# EAGLE design HF1R00 (EAGLE 9.3.0)
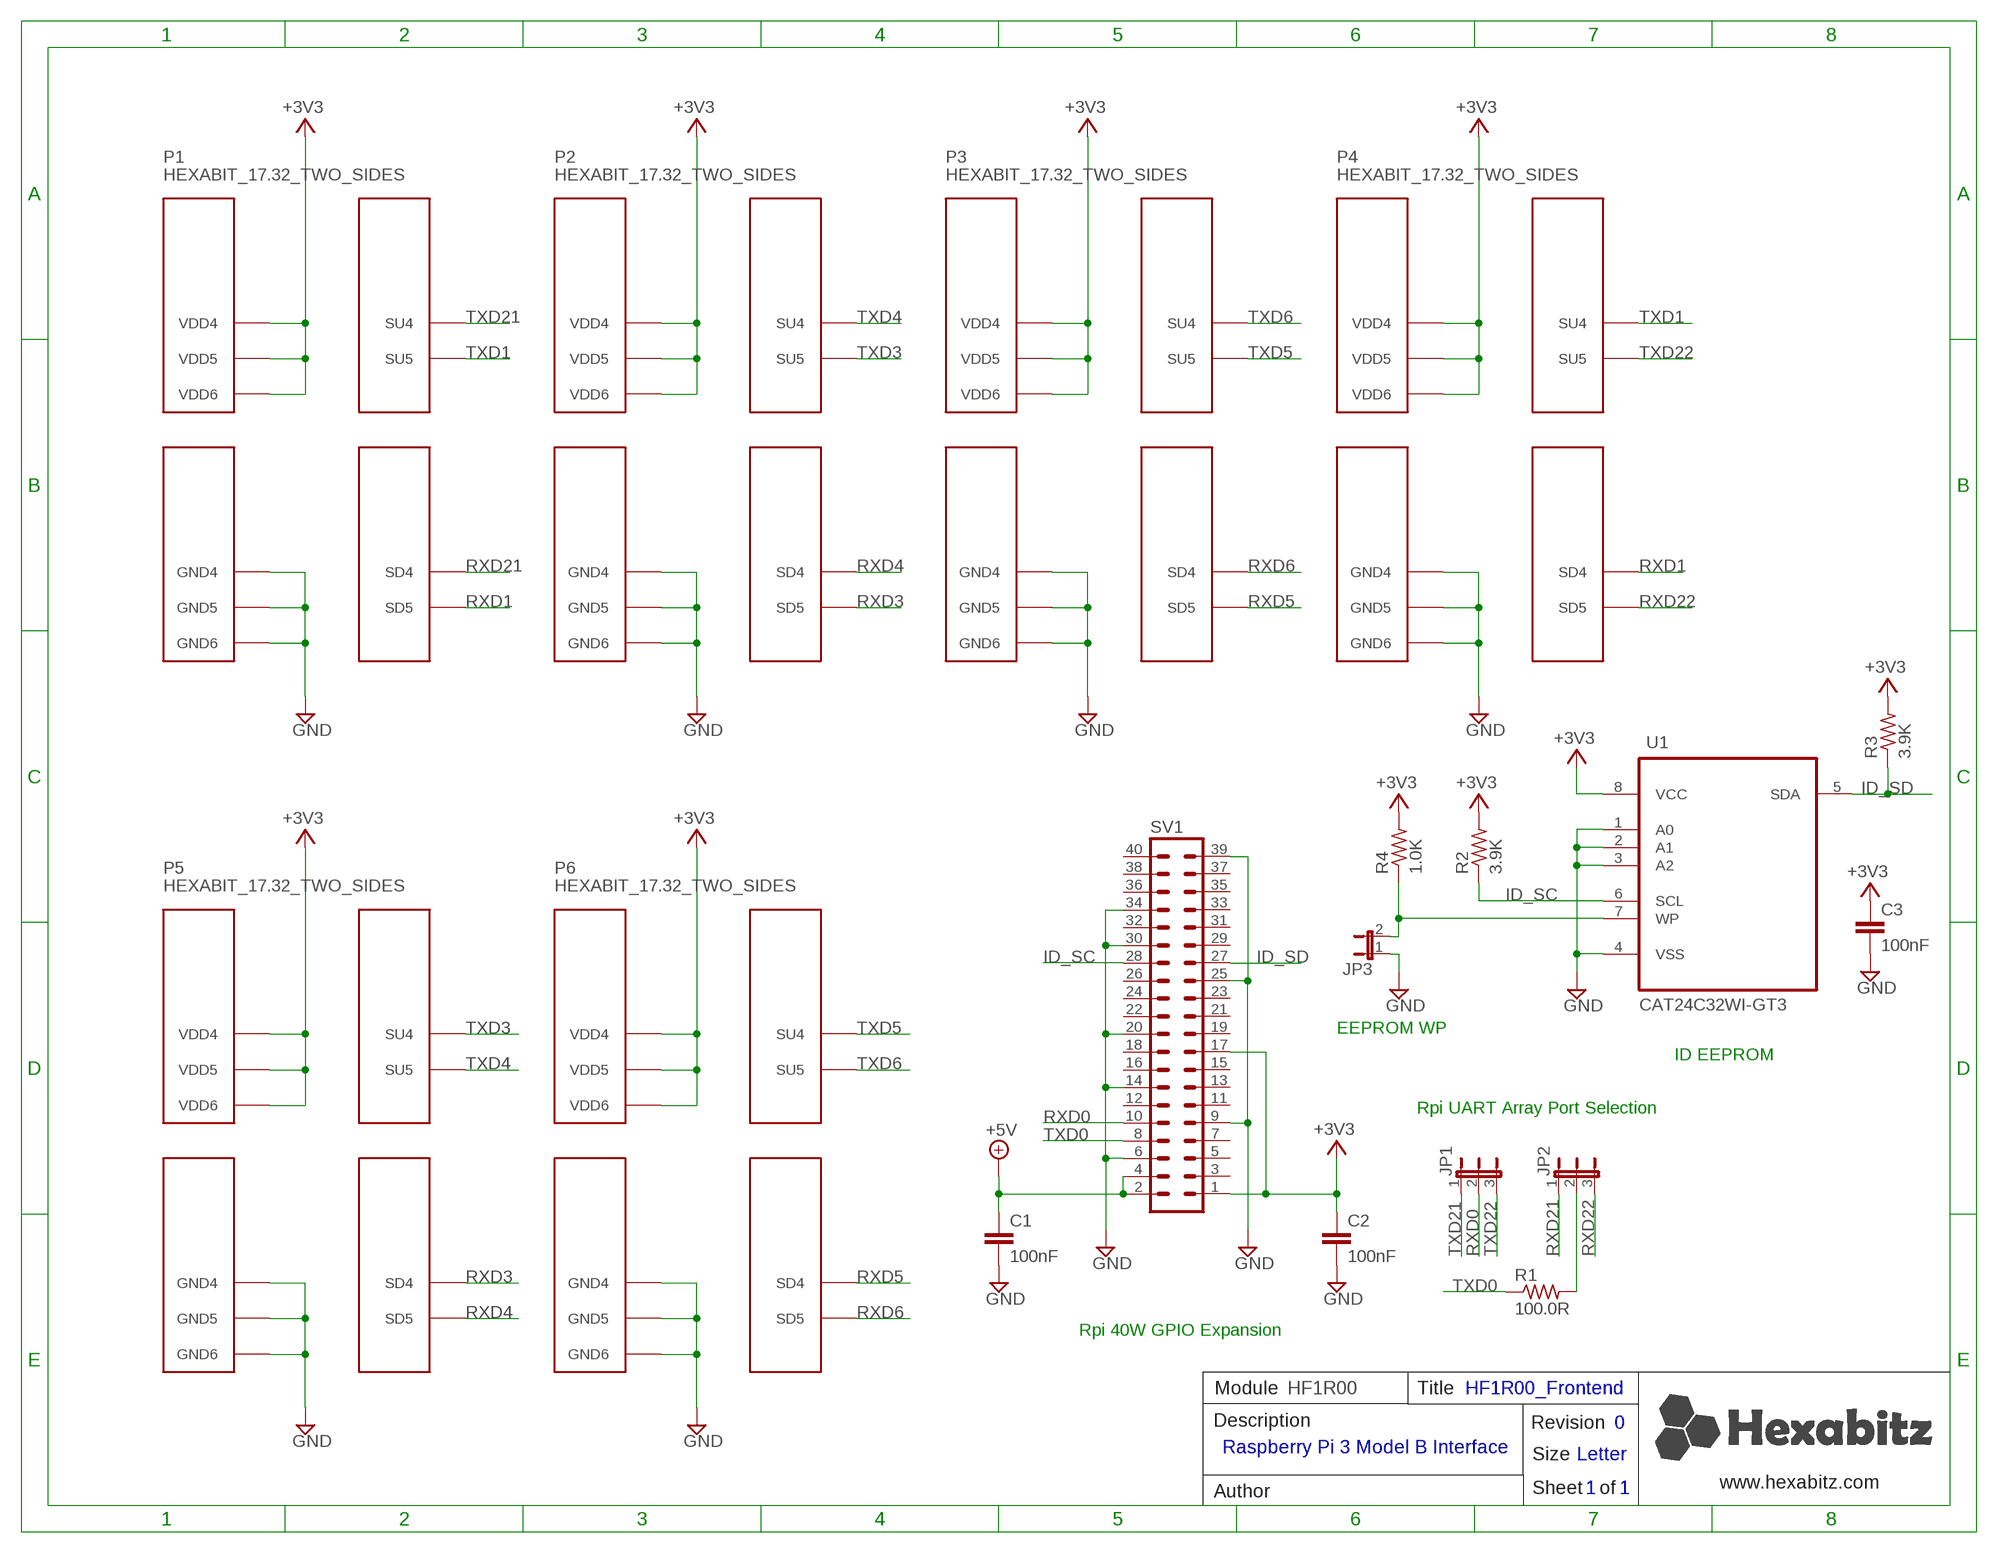
[diagram p0: schematic, sheet 1]

## Parts
C1  100nF  C-0603  [C-0603]
C2  100nF  C-0603  [C-0603]
C3  100nF  C-0603  [C-0603]
JP1  61300311121  JP2E  [JP2]
JP2  61300311121  JP2E  [JP2]
JP3  61300211121  JP1E  [JP1]
P1  HEXABIT_17.32_TWO_SIDES  [HEXABIT_17.32_TWO_SIDES]
P2  HEXABIT_17.32_TWO_SIDES  [HEXABIT_17.32_TWO_SIDES]
P3  HEXABIT_17.32_TWO_SIDES  [HEXABIT_17.32_TWO_SIDES]
P4  HEXABIT_17.32_TWO_SIDES  [HEXABIT_17.32_TWO_SIDES]
P5  HEXABIT_17.32_TWO_SIDES  [HEXABIT_17.32_TWO_SIDES]
P6  HEXABIT_17.32_TWO_SIDES  [HEXABIT_17.32_TWO_SIDES]
R1  100.0R  R-0603  [R-0603]
R2  3.9K  R-0603  [R-0603]
R3  3.9K  R-0603  [R-0603]
R4  1.0K  R-0603  [R-0603]
SV1  PPTC202LFBN-RC  MA20-2  [MA20-2]
U1  CAT24C32WI-GT3  [SOIC127P600X175-8N]

## Nets
+3V3: C2.1 C3.1 P1.PAD_PU10(VDD4) P1.PAD_PU11(VDD5) P1.PAD_PU12(VDD6) P2.PAD_PU10(VDD4) P2.PAD_PU11(VDD5) P2.PAD_PU12(VDD6) P3.PAD_PU10(VDD4) P3.PAD_PU11(VDD5) P3.PAD_PU12(VDD6) P4.PAD_PU10(VDD4) P4.PAD_PU11(VDD5) P4.PAD_PU12(VDD6) P5.PAD_PU10(VDD4) P5.PAD_PU11(VDD5) P5.PAD_PU12(VDD6) P6.PAD_PU10(VDD4) P6.PAD_PU11(VDD5) P6.PAD_PU12(VDD6) R2.2 R3.2 R4.2 SV1.1 SV1.17 U1.8(VCC)
+5V: C1.1 SV1.2 SV1.4
GND: C1.2 C2.2 C3.2 JP3.1 P1.PAD_PD10(GND4) P1.PAD_PD11(GND5) P1.PAD_PD12(GND6) P2.PAD_PD10(GND4) P2.PAD_PD11(GND5) P2.PAD_PD12(GND6) P3.PAD_PD10(GND4) P3.PAD_PD11(GND5) P3.PAD_PD12(GND6) P4.PAD_PD10(GND4) P4.PAD_PD11(GND5) P4.PAD_PD12(GND6) P5.PAD_PD10(GND4) P5.PAD_PD11(GND5) P5.PAD_PD12(GND6) P6.PAD_PD10(GND4) P6.PAD_PD11(GND5) P6.PAD_PD12(GND6) SV1.6 SV1.9 SV1.14 SV1.20 SV1.25 SV1.30 SV1.34 SV1.39 U1.1(A0) U1.2(A1) U1.3(A2) U1.4(VSS)
ID_SC: R2.1 SV1.28 U1.6(SCL)
ID_SD: R3.1 SV1.27 U1.5(SDA)
N$1: JP2.2 R1.2
N$2: JP3.2 R4.1 U1.7(WP)
RXD0: JP1.2 SV1.10
RXD1: P1.PAD_PD5(SD5) P4.PAD_PD4(SD4)
RXD3: P2.PAD_PD5(SD5) P5.PAD_PD4(SD4)
RXD4: P2.PAD_PD4(SD4) P5.PAD_PD5(SD5)
RXD5: P3.PAD_PD5(SD5) P6.PAD_PD4(SD4)
RXD6: P3.PAD_PD4(SD4) P6.PAD_PD5(SD5)
RXD21: JP2.1 P1.PAD_PD4(SD4)
RXD22: JP2.3 P4.PAD_PD5(SD5)
TXD0: R1.1 SV1.8
TXD1: P1.PAD_PU5(SU5) P4.PAD_PU4(SU4)
TXD3: P2.PAD_PU5(SU5) P5.PAD_PU4(SU4)
TXD4: P2.PAD_PU4(SU4) P5.PAD_PU5(SU5)
TXD5: P3.PAD_PU5(SU5) P6.PAD_PU4(SU4)
TXD6: P3.PAD_PU4(SU4) P6.PAD_PU5(SU5)
TXD21: JP1.1 P1.PAD_PU4(SU4)
TXD22: JP1.3 P4.PAD_PU5(SU5)
Unconnected: SV1.3 SV1.5 SV1.7 SV1.11 SV1.12 SV1.13 SV1.15 SV1.16 SV1.18 SV1.19 SV1.21 SV1.22 SV1.23 SV1.24 SV1.26 SV1.29 SV1.31 SV1.32 SV1.33 SV1.35 SV1.36 SV1.37 SV1.38 SV1.40

## Notes on the sheet
- EEPROM WP
- ID EEPROM
- Rpi UART Array Port Selection
- Rpi 40W GPIO Expansion
- Module | HF1R00 | Title | HF1R00_Frontend
- Description | Revision | 0
- Raspberry Pi 3 Model B Interface
- Size | Letter
- www.hexabitz.com
- Author | Sheet   of | 1 | 1

## Library data of the parts
C1-C3 = Hexabitz:C-0603: CAP CER 10% X7R 0603; CAPACITANCE: 100nF; MFN: KEMET; MPN: C0603C104K8RACTU; OCTOPART_URL: https://octopart.com/c0603c104k8ractu-kemet-145075?r=sp&s=9bS9ASSwSEqMCE9KBEQZ0g; TOLERANCE: 10V; VOLTAGE_RATING: 10%
JP1 JP2 = jumper:JP2E: JUMPER; MFN: Wurth Electronics Inc.; MPN: 61300311121; OCTOPART_URL: https://octopart.com/61300311121-w%C3%BCrth+elektronik-32855521?r=sp&s=VUYV3WYRSMmIeK5NbpMggQ
JP3 = jumper:JP1E: JUMPER; MFN: Wurth Electronics Inc.; MPN: 61300211121; OCTOPART_URL: https://octopart.com/61300211121-w%C3%BCrth+elektronik-20081794?r=sp&s=_qjp-sYDSLeHQoC-C2Sr3Q
P1-P6 = hexabitz_connectors:HEXABIT_?_TWO_SIDES: Hexabitz Hexagon Module Connector Hexagon side length = 17.32mm. The following ports are removed: P1 P2 P3 P6 P7 P8 P9
R1 = Hexabitz:R-0603: Thick Film Resistors - SMD 0603; MFN: Panasonic; MPN: ERJ-PA3F1000V; OCTOPART_URL: https://octopart.com/erj-pa3f1000v-panasonic-51302178?r=sp&s=FtfQlVmZQ6G_o34px3VECw; RESISTANCE: 100.0 Ohm; TOLERANCE: 1%
R2 R3 = Hexabitz:R-0603: Thick Film Resistors - SMD 0603; MFN: Vishay; MPN: CRCW06033K90FKEA; OCTOPART_URL: https://octopart.com/crcw06033k90fkea-vishay-40019003?r=sp&s=g-tYgB-WSDSQxdPWmNeinA; RESISTANCE: 3.9 kOhm; TOLERANCE: 1%
R4 = Hexabitz:R-0603: Thick Film Resistors - SMD 0603; MFN: Panasonic; MPN: ERJ-3EKF1001V; OCTOPART_URL: https://octopart.com/erj-3ekf1001v-panasonic-55403646?r=sp&s=_UtQAJDmTsiNho0Uqf11iA; RESISTANCE: 1.0 kOhm; TOLERANCE: 1%
SV1 = con-lstb:MA20-2: PIN HEADER; MF: Sullins Connector Solutions; MPN: PPTC202LFBN-RC; MPN1: PPTC202LFBN-RC; MPN2: SSQ-120-03-T-D; OCTOPART_URL1: https://octopart.com/pptc202lfbn-rc-sullins-271016?r=sp&s=1RfKK7RTTQWXnb_X-lIgDg; OCTOPART_URL2: https://octopart.com/ssq-120-03-t-d-samtec-295827?r=sp&s=ndA-bJp5RcuLpe9xjEJGvQ; OC_FARNELL: unknown; OC_NEWARK: unknown
U1 = Hexabitz:CAT24C32WI-GT3: 32-Kb I2C CMOS Serial EEPROM; AVAILABILITY: Unavailable; MFN: ON; MPN: CAT24C32WI-GT3; OCTOPART_URL: https://octopart.com/cat24c32wi-gt3-on+semiconductor-46637079?r=sp&s=FKlwZf5pQnKrnKEoFDDqWA; PACKAGE: SOIC-8 ON; PRICE: None

## Board
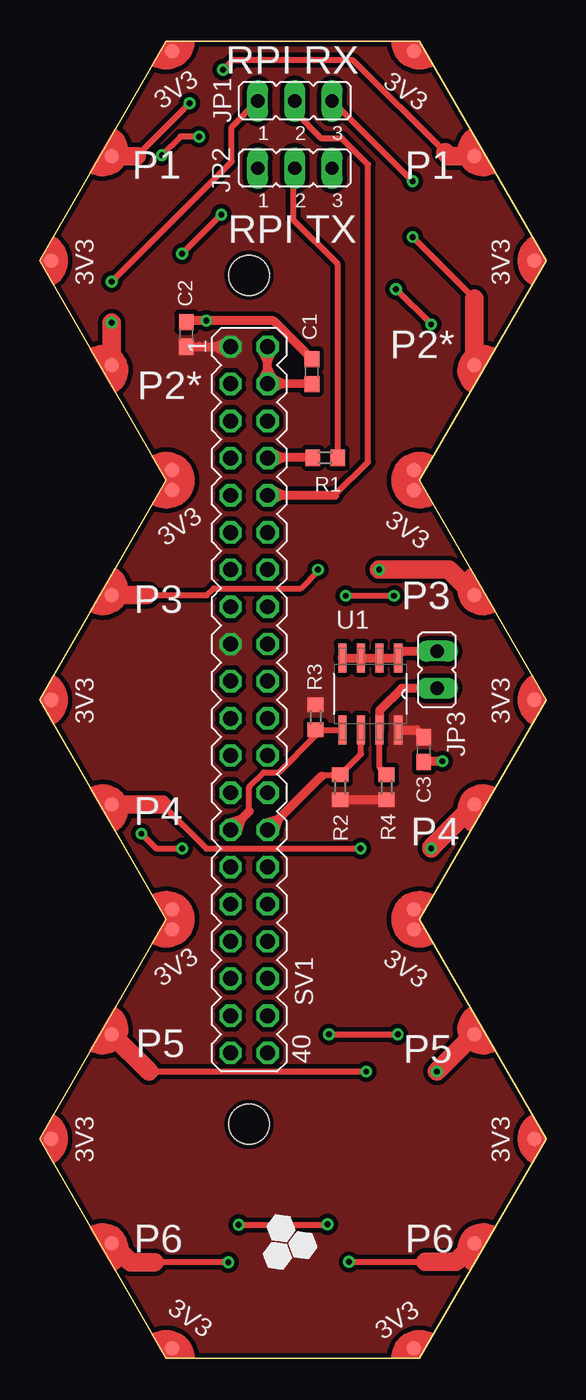
[diagram p1: board, top side]
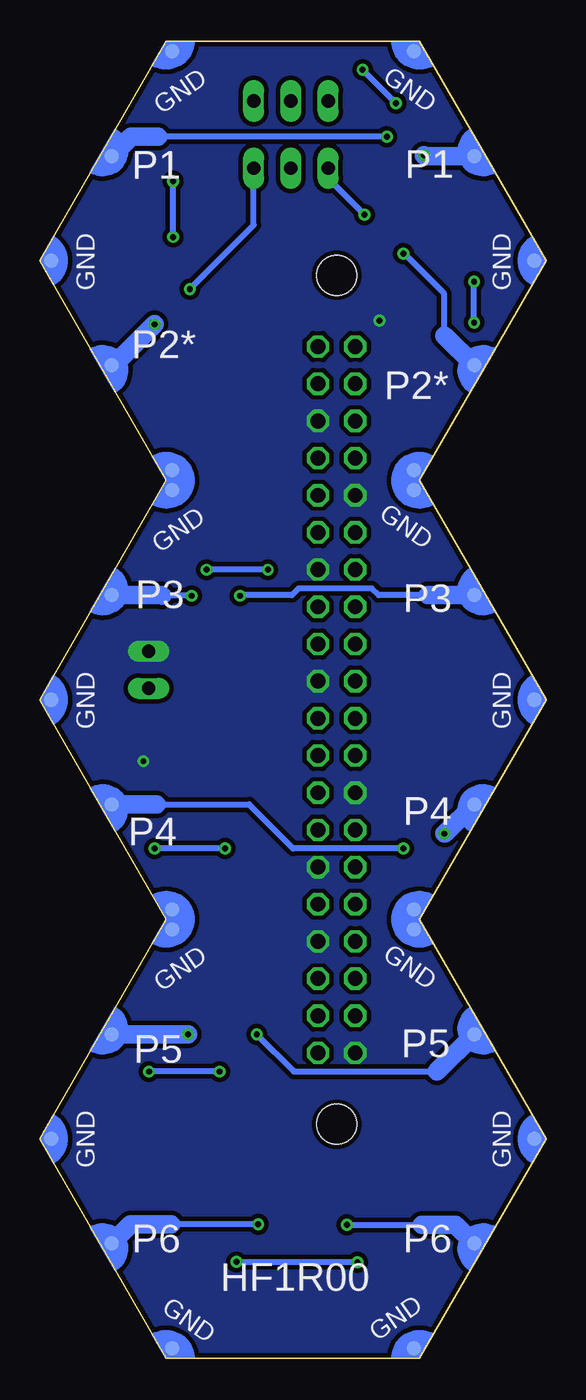
[diagram p2: board, bottom side, seen from below]

Size 34.64 x 90.01 mm. Coordinates in mm from the lower left corner, seen from the top.
Outline: 8.66,90.01 0,75 8.66,60 0,45.01 8.66,30 0,15 8.66,0 25.98,0 34.64,15 25.98,30 34.64,45 25.98,60 34.64,75 25.98,90.01 8.66,90.01
Copper layers (1*16): Top 0.035mm / dielectric 1.5mm / Bottom 0.035mm
Design rules "2_layer": minimum track width 7mil, minimum drill 10mil, track to track 6mil, track to pad 6mil, pad to pad 6mil, via to via 6mil, smd to smd 0mil, copper to edge 1mil, drill to drill 8mil, minimum pad ring 10mil, minimum via ring 8mil, stop-mask expansion 2mil, vias tented up to drill 15mil, thermal gap 10mil
Holes 2.75 mm at 14.32,16 14.32,74
tKeepout: area 11.2,70.9 to 17.4,77.1; area 11.2,12.9 to 17.4,19.1
bKeepout: area 11.2,12.9 to 17.4,19.1; area 11.2,70.9 to 17.4,77.1

### Footprints (pad centres in the part's own frame; a part is rotated, then mirrored left to right if it is on the bottom)
C-0603 = smd 1.1 x 1: 1 -0.85,0; 2 0.85,0
JP2 = drill 0.914 long: 1 -2.54,0; 2 0,0; 3 2.54,0
JP1 = drill 0.914 long: 1 0,-1.27; 2 0,1.27
HEXABIT_17.32_TWO_SIDES = smd 1 x 1 bottom: PAD_PD4 -12.39,-7.15; PAD_PD5 -12.39,7.15; PAD_PD10 -8.26,-14.31; PAD_PD11 -16.52,0; PAD_PD12 -8.26,14.31 | smd 1 x 1: PAD_PU4 -12.39,-7.15; PAD_PU5 -12.39,7.15; PAD_PU10 -8.26,-14.31; PAD_PU11 -16.52,0; PAD_PU12 -8.26,14.31
R-0603 = smd 1 x 1.1: 1 -0.85,0; 2 0.85,0
MA20-2 = drill 1.016 octagon: 1 -24.13,-1.27; 2 -24.13,1.27; 3 -21.59,-1.27; 4 -21.59,1.27; 5 -19.05,-1.27; 6 -19.05,1.27; 7 -16.51,-1.27; 8 -16.51,1.27; 9 -13.97,-1.27; 10 -13.97,1.27; 11 -11.43,-1.27; 12 -11.43,1.27; 13 -8.89,-1.27; 14 -8.89,1.27; 15 -6.35,-1.27; 16 -6.35,1.27; 17 -3.81,-1.27; 18 -3.81,1.27; 19 -1.27,-1.27; 20 -1.27,1.27; 21 1.27,-1.27; 22 1.27,1.27; 23 3.81,-1.27; 24 3.81,1.27; 25 6.35,-1.27; 26 6.35,1.27; 27 8.89,-1.27; 28 8.89,1.27; 29 11.43,-1.27; 30 11.43,1.27; 31 13.97,-1.27; 32 13.97,1.27; 33 16.51,-1.27; 34 16.51,1.27; 35 19.05,-1.27; 36 19.05,1.27; 37 21.59,-1.27; 38 21.59,1.27; 39 24.13,-1.27; 40 24.13,1.27
SOIC127P600X175-8N = smd 1.981 x 0.559: 1 -2.464,1.905; 2 -2.464,0.635; 3 -2.464,-0.635; 4 -2.464,-1.905; 5 2.464,-1.905; 6 2.464,-0.635; 7 2.464,0.635; 8 2.464,1.905

### Placement (x,y rotation side)
C1  18.62,67.42 90 top
C2  10.04,69.96 90 top
C3  26.27,41.59 270 top
JP1  17.46,85.91 0 top
JP2  17.46,81.32 0 top
JP3  27.18,47.05 180 top
P1  17.32,75 0 top
P2  17.32,45 0 top
P3  17.32,15 0 top
P4  17.32,75 180 top
P5  17.32,45 180 top
P6  17.32,15 180 top
R1  19.54,61.53 0 top
R2  20.55,39.03 270 top
R3  18.88,43.8 90 top
R4  23.73,39.03 270 top
SV1  14.33,45 270 top
U1  22.61,45.4 270 top

### Tracks (layer width: path | path; a pad name or v marks a point on that pad's centre or on a via)
+3V3
  Top 0.61: C2.1 10.91,69.13 12.05,69.13 | 12.05,69.13 SV1.1 | U1.8 25.77,42.94 C3.1 | R2.2 R4.2 | 12.05,69.13 | 12.05,69.13 | 12.05,69.13 12.86,69.54 | 12.05,69.13 12.86,68.72 | 12.86,68.72 | SV1.1 12.86,68.72 | 12.05,69.13 12.86,69.54 | SV1.1 12.86,69.54 | 12.05,69.13 12.86,68.72 | SV1.1 12.86,68.72 | 12.05,69.13 12.86,69.54 | SV1.1 12.86,69.54
  pour Top (isolate 0.305, no thermals): 8.66,30 0,45.01 8.66,60 0,75 8.66,90.01 25.98,90.01 34.64,75 25.98,60 34.64,45 25.98,30 34.64,15 25.98,0 8.66,0 0,15
+5V
  Top 0.61: C1.1 16.62,66.59 | 16.62,66.59 SV1.4 | SV1.4 15.6,67.61 | 15.6,67.61 15.6,68.12 | 15.6,68.12 SV1.2 | 15.6,67.61 | 15.6,67.61 | 15.6,67.61 16.01,66.8 | 16.62,66.59 15.81,67 SV1.4 | 16.62,66.59 15.81,66.18 SV1.4 | 15.6,67.61 15.19,66.8 | 15.19,66.8 | SV1.4 15.19,66.8 | 15.6,67.61 16.01,66.8 | SV1.4 16.01,66.8 | 15.6,67.61 15.19,66.8 | SV1.4 15.19,66.8 | 15.6,67.61 16.01,66.8 | SV1.4 16.01,66.8 | 15.6,68.12 16.01,68.93 | 16.01,68.93 | SV1.2 16.01,68.93 | 15.6,68.12 15.19,68.93 | SV1.2 15.19,68.93 | 15.6,68.12 16.01,68.93 | SV1.2 16.01,68.93 | 15.6,68.12 15.19,68.93 | SV1.2 15.19,68.93
GND  (via drill 0.4)
  Top 0.61: U1.4 U1.3 U1.2 U1.1 arc-90 24.97,48.32 JP3.1 | C3.2 arc-90 26.33,40.8 v27.54,40.8 | C1.2 15.99,70.9 v11.41,70.9 10.13,70.9 C2.2
  pour Bottom (isolate 0.305, no thermals): 8.66,30 0,45.01 8.66,60 0,75 8.66,90.01 25.98,90.01 34.64,75 25.98,60 34.64,45 25.98,30 34.64,15 25.98,0 8.66,0 0,15
ID_SC
  Top 0.406: 19.28,39.79 19.37,39.88 R2.1 21.98,41.3 U1.6
  Top 0.61: SV1.28 16.32,36.83 | 16.32,36.83 19.28,39.79 | 16.32,36.83 15.46,36.55 SV1.28 | 16.32,36.83 16.04,35.97 SV1.28
ID_SD
  Top 0.406: U1.5 20.69,42.95 R3.1 18.88,42.56 16.36,40.04 15.35,40.04 14.33,39.03 14.33,37.38
  Top 0.61: SV1.27 13.78,36.83 | 13.78,36.83 14.33,37.38 | 13.78,36.83 12.92,36.55 SV1.27 | 13.78,36.83 13.5,35.97 SV1.27
N$1
  Top 0.406: R1.2 20.39,74.75 17.38,77.76 17.38,81.24 JP2.2
N$2
  Top 0.406: R4.1 23.25,40.36 U1.7
  Top 0.61: JP3.2 24.77,45.78 23.25,44.26 U1.7
RXD0
  Top 0.406: 20.18,58.97 22.46,61.25 22.46,81.57 20.68,83.35 19.28,83.35 17.46,85.18 JP1.2
  Top 0.61: SV1.10 16.62,58.97 | 16.62,58.97 20.18,58.97 | 16.62,58.97 15.81,59.38 | 15.81,59.38 | SV1.10 15.81,59.38 | 16.62,58.97 15.81,58.56 | SV1.10 15.81,58.56 | 16.62,58.97 15.81,59.38 | SV1.10 15.81,59.38 | 16.62,58.97 15.81,58.56 | SV1.10 15.81,58.56
RXD1  (via drill 0.4)  (1 unrouted)
  Top 0.406: v10.9,83.48 9.63,83.48 v8.36,82.21
  Bottom 0.406: v10.9,83.48 26.52,83.48
  Bottom 1.27: P4.PAD_PD4 28.39,83.48 26.52,83.48 | 4.99,82.21 4.98,82.2 4.95,82.14 | P1.PAD_PD5 8.31,82.15 v8.36,82.21
RXD3  (via drill 0.4)
  Top 0.406: v20.94,52.11 v24.24,52.11
  Bottom 0.406: 8.11,52.15 11.45,52.15 11.92,52.62 16.93,52.62 17.39,52.15 20.89,52.15 v20.94,52.11 | v24.24,52.11 26.27,52.11 29.67,52.11 P5.PAD_PD4
  Bottom 1.27: P5.PAD_PD4 26.31,52.15 26.27,52.11 | P2.PAD_PD5 8.11,52.15
RXD4  (via drill 0.4)
  Top 0.406: v9.76,34.84 7.98,34.84 v6.97,35.85
  Bottom 0.406: P2.PAD_PD4 4.97,37.85 v6.97,35.85 | 26.65,37.85 20.31,37.85 17.3,34.84 v9.76,34.84
  Bottom 1.27: P2.PAD_PD4 6.93,35.85 v6.97,35.85 | P5.PAD_PD5 26.65,37.85
RXD5  (via drill 0.4)
  Top 0.406: v19.79,22.14 v24.49,22.14
  Bottom 0.406: v19.79,22.14 17.25,19.6 7.49,19.6
  Bottom 1.27: 7.49,19.6 P3.PAD_PD5 | P6.PAD_PD4 29.7,22.14 v24.49,22.14
RXD6  (via drill 0.4)
  Top 0.406: v13.62,9.13 19.67,9.13 v19.69,9.16
  Bottom 0.406: v19.69,9.16 25.63,9.16 | v13.62,9.13 8.49,9.13
  Bottom 1.27: P3.PAD_PD4 6.21,9.13 8.49,9.13 | P6.PAD_PD5 28.41,9.16 25.63,9.16
RXD21  (via drill 0.4)
  Top 0.406: v9.76,75.48 v12.43,78.14
  Bottom 0.406: 6.97,69.89 6.97,72.73 9.71,75.48 v9.76,75.48 | v12.43,78.14 14.92,80.63 JP2.1
  Bottom 1.27: P1.PAD_PD4 6.97,69.89
RXD22  (via drill 0.4)
  Top 0.406: v24.36,73.06 v26.78,70.65
  Bottom 0.406: v24.36,73.06 20,77.43 JP2.3
  Bottom 1.27: P4.PAD_PD5 29.58,67.85 v26.78,70.65
TXD0
  Top 0.61: R1.1 16.62,61.53 | 16.62,61.53 15.62,61.53 SV1.8 | 16.62,61.53 15.8,61.92 SV1.8 | 16.62,61.53 15.81,61.11 SV1.8
TXD1  (via drill 0.4)
  Top 0.406: 6.66,82.15 v10.27,85.76 | v12.55,88.05 13.19,88.68 21.44,88.68 27.73,82.4
  Top 1.27: P4.PAD_PU4 27.98,82.15 27.73,82.4 | P1.PAD_PU5 6.66,82.15
  Bottom 0.406: v12.55,88.05 v10.27,85.76
TXD3  (via drill 0.4)
  Top 0.406: 7.35,52.15 11.45,52.15 11.92,52.62 17.86,52.62 19.03,53.78 v19.03,53.89
  Top 1.27: P2.PAD_PU5 7.35,52.15 | P5.PAD_PU4 27.98,53.89 v23.22,53.89
  Bottom 0.406: v19.03,53.89 v23.22,53.89
TXD4  (via drill 0.4)  (1 unrouted)
  Top 0.406: 8.39,37.85 11.41,34.84 v21.95,34.84
  Top 1.27: P2.PAD_PU4 8.39,37.85 | 29.56,37.61 29.7,37.86 | P5.PAD_PU5 26.78,34.92 v26.78,34.84
  Bottom 0.406: v21.95,34.84 v26.78,34.84
TXD5  (via drill 0.4)  (1 unrouted)
  Top 0.406: 7.49,19.6 v22.33,19.6
  Top 1.27: P3.PAD_PU5 7.49,19.6 | v27.16,19.6 29.7,22.13 29.7,22.14
  Bottom 0.406: v22.33,19.6 v27.16,19.6
TXD6  (via drill 0.4)
  Top 0.406: P6.PAD_PU5 28.44,6.58 28.43,6.59 26.4,6.59 v21.16,6.59 | v12.91,6.57 7.85,6.57
  Top 1.27: P3.PAD_PU4 6.22,6.57 7.85,6.57 | P6.PAD_PU5 28.45,6.59 26.4,6.59
  Bottom 0.406: v12.91,6.57 21.14,6.57 v21.16,6.59
TXD21  (via drill 0.4)
  Top 0.406: JP1.1 13.14,84.14 13.14,81.77 v4.93,73.57 | P1.PAD_PU4 v4.93,70.78
  Top 1.27: P1.PAD_PU4 v4.93,70.77 v4.93,70.78
  Bottom 0.406: v4.93,70.78 v4.93,73.57
TXD22  (via drill 0.4)
  Top 0.406: 29.71,72.42 v25.52,76.62 v25.51,76.62 | v25.51,80.43 25.48,80.43 JP1.3
  Top 1.27: P4.PAD_PU5 29.71,72.42
  Bottom 0.406: v25.51,76.62 v25.51,80.43

### Text on the board
tPlace: RPI RX | 3V3 | 3V3 | P1 | P1 | RPI TX | 3V3 | 3V3 | P2* | P2* | 3V3 | 3V3 | P3 | P3 | 3V3 | 3V3 | P4 | P4 | 3V3 | 3V3 | P5 | P5 | 3V3 | 3V3 | P6 | P6 | 3V3 | 3V3
bPlace: GND | GND | P1 | P1 | GND | GND | P2* | P2* | GND | GND | P3 | P3 | GND | GND | P4 | P4 | GND | GND | P5 | P5 | GND | GND | P6 | P6 | HF1R00 | GND | GND